# Altium project adio.PRJPCB
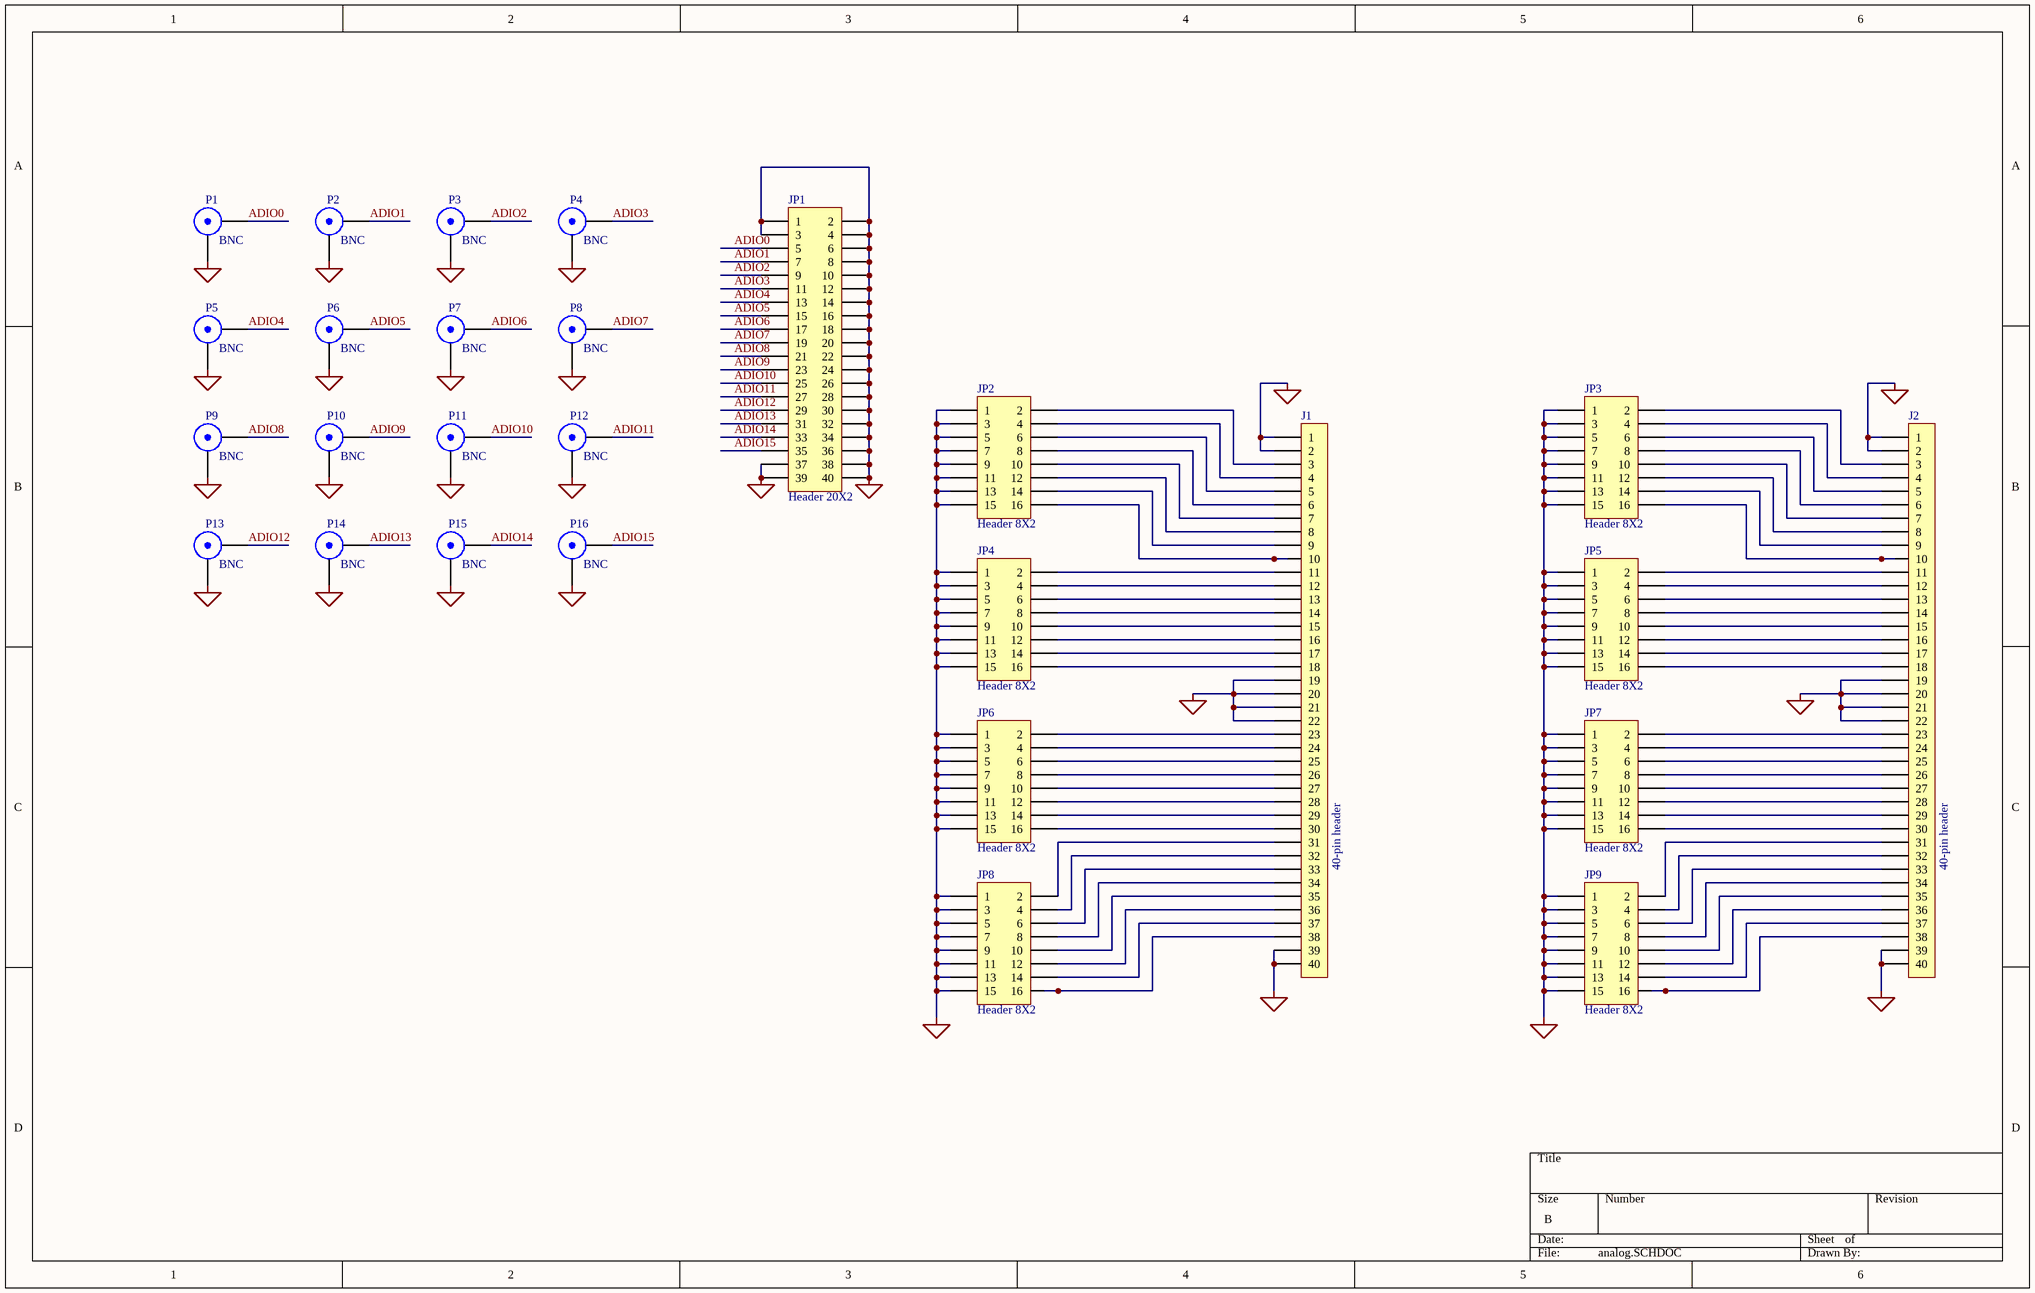
[diagram p0: analog.SCHDOC]
1 sheet, 27 parts. Net scope: global (net labels, ports and power ports of the same name join across sheets).
Board file: adio.PCBDOC

## Sheet analog.SCHDOC
size B

### Parts
J1  40-pin header  [HDR2X20]
J2  40-pin header  [HDR2X20]
JP1  Header 20X2  [HDR2X20]
JP2  Header 8X2  [HDR2X8]
JP3  Header 8X2  [HDR2X8]
JP4  Header 8X2  [HDR2X8]
JP5  Header 8X2  [HDR2X8]
JP6  Header 8X2  [HDR2X8]
JP7  Header 8X2  [HDR2X8]
JP8  Header 8X2  [HDR2X8]
JP9  Header 8X2  [HDR2X8]
P1  BNC  [Vertical BNC 227699-1]
P2  BNC  [Vertical BNC 227699-1]
P3  BNC  [Vertical BNC 227699-1]
P4  BNC  [Vertical BNC 227699-1]
P5  BNC  [Vertical BNC 227699-1]
P6  BNC  [Vertical BNC 227699-1]
P7  BNC  [Vertical BNC 227699-1]
P8  BNC  [Vertical BNC 227699-1]
P9  BNC  [Vertical BNC 227699-1]
P10  BNC  [Vertical BNC 227699-1]
P11  BNC  [Vertical BNC 227699-1]
P12  BNC  [Vertical BNC 227699-1]
P13  BNC  [Vertical BNC 227699-1]
P14  BNC  [Vertical BNC 227699-1]
P15  BNC  [Vertical BNC 227699-1]
P16  BNC  [Vertical BNC 227699-1]

### Nets
AGND: JP1.1 JP1.2 JP1.3 JP1.4 JP1.6 JP1.8 JP1.10 JP1.12 JP1.14 JP1.16 JP1.18 JP1.20 JP1.22 JP1.24 JP1.26 JP1.28 JP1.30 JP1.32 JP1.34 JP1.36 JP1.37 JP1.38 JP1.39 JP1.40 P1.2(Y) P2.2(Y) P3.2(Y) P4.2(Y) P5.2(Y) P6.2(Y) P7.2(Y) P8.2(Y) P9.2(Y) P10.2(Y) P11.2(Y) P12.2(Y) P13.2(Y) P14.2(Y) P15.2(Y) P16.2(Y)
DGND: J1.1 J1.2 J1.19 J1.20 J1.21 J1.22 J1.39 J1.40 J2.1 J2.2 J2.19 J2.20 J2.21 J2.22 J2.39 J2.40 JP2.1 JP2.3 JP2.5 JP2.7 JP2.9 JP2.11 JP2.13 JP2.15 JP3.1 JP3.3 JP3.5 JP3.7 JP3.9 JP3.11 JP3.13 JP3.15 JP4.1 JP4.3 JP4.5 JP4.7 JP4.9 JP4.11 JP4.13 JP4.15 JP5.1 JP5.3 JP5.5 JP5.7 JP5.9 JP5.11 JP5.13 JP5.15 JP6.1 JP6.3 JP6.5 JP6.7 JP6.9 JP6.11 JP6.13 JP6.15 JP7.1 JP7.3 JP7.5 JP7.7 JP7.9 JP7.11 JP7.13 JP7.15 JP8.1 JP8.3 JP8.5 JP8.7 JP8.9 JP8.11 JP8.13 JP8.15 JP9.1 JP9.3 JP9.5 JP9.7 JP9.9 JP9.11 JP9.13 JP9.15
ADIO0: JP1.5 P1.1(X)
ADIO1: JP1.7 P2.1(X)
ADIO2: JP1.9 P3.1(X)
ADIO3: JP1.11 P4.1(X)
ADIO4: JP1.13 P5.1(X)
ADIO5: JP1.15 P6.1(X)
ADIO6: JP1.17 P7.1(X)
ADIO7: JP1.19 P8.1(X)
ADIO8: JP1.21 P9.1(X)
ADIO9: JP1.23 P10.1(X)
ADIO10: JP1.25 P11.1(X)
ADIO11: JP1.27 P12.1(X)
ADIO12: JP1.29 P13.1(X)
ADIO13: JP1.31 P14.1(X)
ADIO14: JP1.33 P15.1(X)
ADIO15: JP1.35 P16.1(X)
NetJ1_3: J1.3 JP2.2
NetJ1_4: J1.4 JP2.4
NetJ1_5: J1.5 JP2.6
NetJ1_6: J1.6 JP2.8
NetJ1_7: J1.7 JP2.10
NetJ1_8: J1.8 JP2.12
NetJ1_9: J1.9 JP2.14
NetJ1_10: J1.10 JP2.16
NetJ1_11: J1.11 JP4.2
NetJ1_12: J1.12 JP4.4
NetJ1_13: J1.13 JP4.6
NetJ1_14: J1.14 JP4.8
NetJ1_15: J1.15 JP4.10
NetJ1_16: J1.16 JP4.12
NetJ1_17: J1.17 JP4.14
NetJ1_18: J1.18 JP4.16
NetJ1_23: J1.23 JP6.2
NetJ1_24: J1.24 JP6.4
NetJ1_25: J1.25 JP6.6
NetJ1_26: J1.26 JP6.8
NetJ1_27: J1.27 JP6.10
NetJ1_28: J1.28 JP6.12
NetJ1_29: J1.29 JP6.14
NetJ1_30: J1.30 JP6.16
NetJ1_31: J1.31 JP8.2
NetJ1_32: J1.32 JP8.4
NetJ1_33: J1.33 JP8.6
NetJ1_34: J1.34 JP8.8
NetJ1_35: J1.35 JP8.10
NetJ1_36: J1.36 JP8.12
NetJ1_37: J1.37 JP8.14
NetJ1_38: J1.38 JP8.16
NetJ2_3: J2.3 JP3.2
NetJ2_4: J2.4 JP3.4
NetJ2_5: J2.5 JP3.6
NetJ2_6: J2.6 JP3.8
NetJ2_7: J2.7 JP3.10
NetJ2_8: J2.8 JP3.12
NetJ2_9: J2.9 JP3.14
NetJ2_10: J2.10 JP3.16
NetJ2_11: J2.11 JP5.2
NetJ2_12: J2.12 JP5.4
NetJ2_13: J2.13 JP5.6
NetJ2_14: J2.14 JP5.8
NetJ2_15: J2.15 JP5.10
NetJ2_16: J2.16 JP5.12
NetJ2_17: J2.17 JP5.14
NetJ2_18: J2.18 JP5.16
NetJ2_23: J2.23 JP7.2
NetJ2_24: J2.24 JP7.4
NetJ2_25: J2.25 JP7.6
NetJ2_26: J2.26 JP7.8
NetJ2_27: J2.27 JP7.10
NetJ2_28: J2.28 JP7.12
NetJ2_29: J2.29 JP7.14
NetJ2_30: J2.30 JP7.16
NetJ2_31: J2.31 JP9.2
NetJ2_32: J2.32 JP9.4
NetJ2_33: J2.33 JP9.6
NetJ2_34: J2.34 JP9.8
NetJ2_35: J2.35 JP9.10
NetJ2_36: J2.36 JP9.12
NetJ2_37: J2.37 JP9.14
NetJ2_38: J2.38 JP9.16

### Library data of the parts
J1 J2 = 40PINHEADER: Simple 40pin connector
JP1 = Header 20X2: Header, 20-Pin, Dual row; Manufacturer: Generic Components; Class I: Connector; Revision: July-2002: Re-released for DXP Platform.; Publisher: Altium Limited
JP2-JP9 = Header 8X2: Header, 8-Pin, Dual row; Manufacturer: Generic Components; Class I: Connector; Revision: July-2002: Re-released for DXP Platform.; Publisher: Altium Limited
P1-P16 = BNC: BNC Elbow Connector; Manufacturer: Generic Components; Class II: RF Coaxial; Revision: July-2002: Re-released for DXP Platform.; Publisher: Altium Limited; Class I: Connector